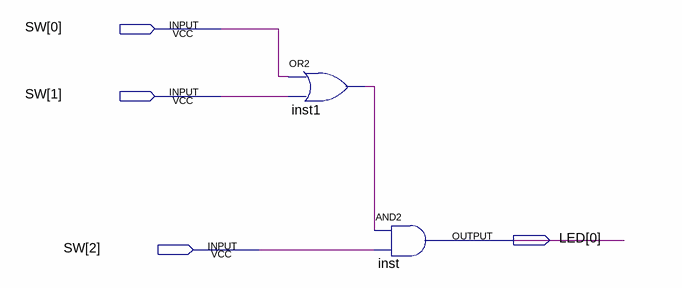
[diagram p0: schematic sheet]
// Quartus schematic ex2.bdf as structural Verilog: 2 symbols, 4 pins
module ex2 (
  input  [2:0] SW,
  output [0:0] LED
);

  wire inst1_out;

  or inst1 (inst1_out, SW[0], SW[1]);
  and inst (LED[0], inst1_out, SW[2]);
endmodule
